# EAGLE design Hermit Board Rev A3 (EAGLE 6.6.0)
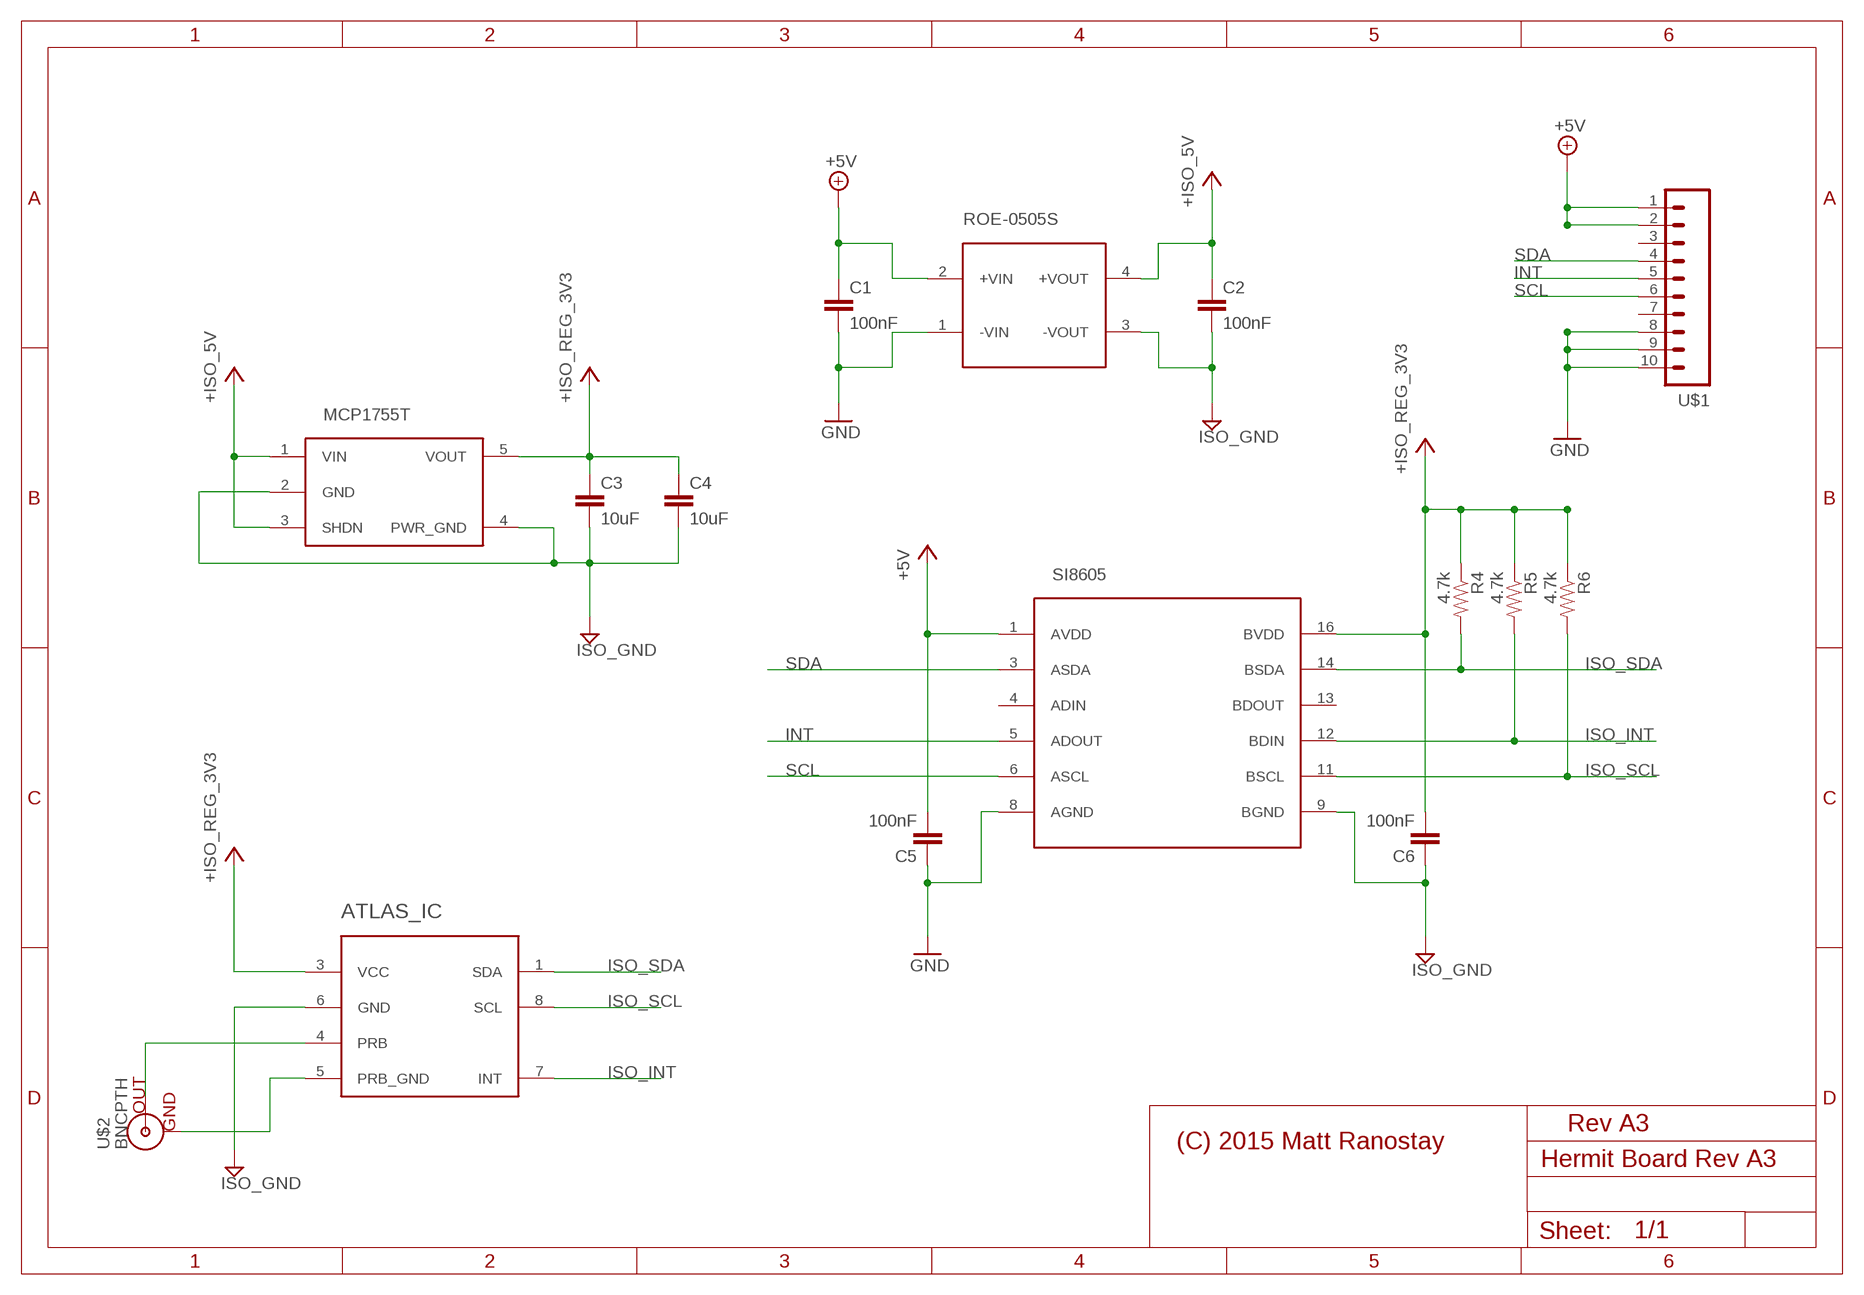
[diagram p0: schematic, sheet 1]

## Parts
ATLAS_IC  ATLAS-OEM  [ATLAS-OEM]
C1  100nF  CAP0805  [0805]
C2  100nF  CAP0805  [0805]
C3  10uF  CAP0805  [0805]
C4  10uF  CAP0805  [0805]
C5  100nF  CAP0805  [0805]
C6  100nF  CAP0805  [0805]
MCP1755T  MCP1755T  [SOT-23-5]
R4  4.7k  RESISTOR0805-RES  [0805]
R5  4.7k  RESISTOR0805-RES  [0805]
R6  4.7k  RESISTOR0805-RES  [0805]
ROE-0505S  ROE-0505S  [SIP4]
SI8605  SI8605  [SOIC16-1.27-10X3.9MM]
U$1  M10SILK_FEMALE_PTH  [1X10]
U$2  BNCPTH  [BNC]

## Nets
+3V3: ATLAS_IC.3(VCC) C3.1 C4.1 C6.2 MCP1755T.5(VOUT) R4.1 R5.1 R6.1 SI8605.16(BVDD) ; supply symbol labelled +ISO_REG_3V3
+5V: C1.1 C5.2 ROE-0505S.2(+VIN) SI8605.1(AVDD) U$1.1 U$1.2
+ISO_5V: C2.1 MCP1755T.1(VIN) MCP1755T.3(SHDN) ROE-0505S.4(+VOUT)
GND: C1.2 C5.1 ROE-0505S.1(-VIN) SI8605.8(AGND) U$1.8 U$1.9 U$1.10
INT: SI8605.5(ADOUT) U$1.5
ISO_GND: ATLAS_IC.6(GND) C2.2 C3.2 C4.2 C6.1 MCP1755T.2(GND) MCP1755T.4(PWR_GND) ROE-0505S.3(-VOUT) SI8605.9(BGND)
ISO_INT: ATLAS_IC.7(INT) R5.2 SI8605.12(BDIN)
ISO_SCL: ATLAS_IC.8(SCL) R6.2 SI8605.11(BSCL)
ISO_SDA: ATLAS_IC.1(SDA) R4.2 SI8605.14(BSDA)
N$5: ATLAS_IC.4(PRB) U$2.S(OUT)
PRB_GND: ATLAS_IC.5(PRB_GND) U$2.GND
SCL: SI8605.6(ASCL) U$1.6
SDA: SI8605.3(ASDA) U$1.4
Unconnected: SI8605.4(ADIN) SI8605.13(BDOUT) U$1.3 U$1.7

## Notes on the sheet
- Rev A3
- (C) 2015 Matt Ranostay

## Library data of the parts
ATLAS_IC = mranostay:ATLAS-OEM
C1-C6 = SparkFun-Capacitors:CAP: Capacitor Standard 0603 ceramic capacitor, and 0.1" leaded capacitor.
MCP1755T = mranostay:MCP1755T
R4-R6 = SparkFun-Passives:RESISTOR: Resistor Basic schematic elements and footprints for 0603, 1206, and PTH resistors.
ROE-0505S = mranostay:ROE-0505S
SI8605 = mranostay:SI8605
U$1 = SparkFun-Connectors:M10: Header 10 Standard 10-pin 0.1" header. Use with straight break away headers (SKU : PRT-00116), right angle break away headers (PRT-00553), swiss pins (PRT-00743), machine pins (PRT-00117), and female headers (PRT-00115).; PROD_ID: CONN-11563
U$2 = SparkFun-Connectors:BNC: BNC Connector, Mouser Part# 5227161

## Board
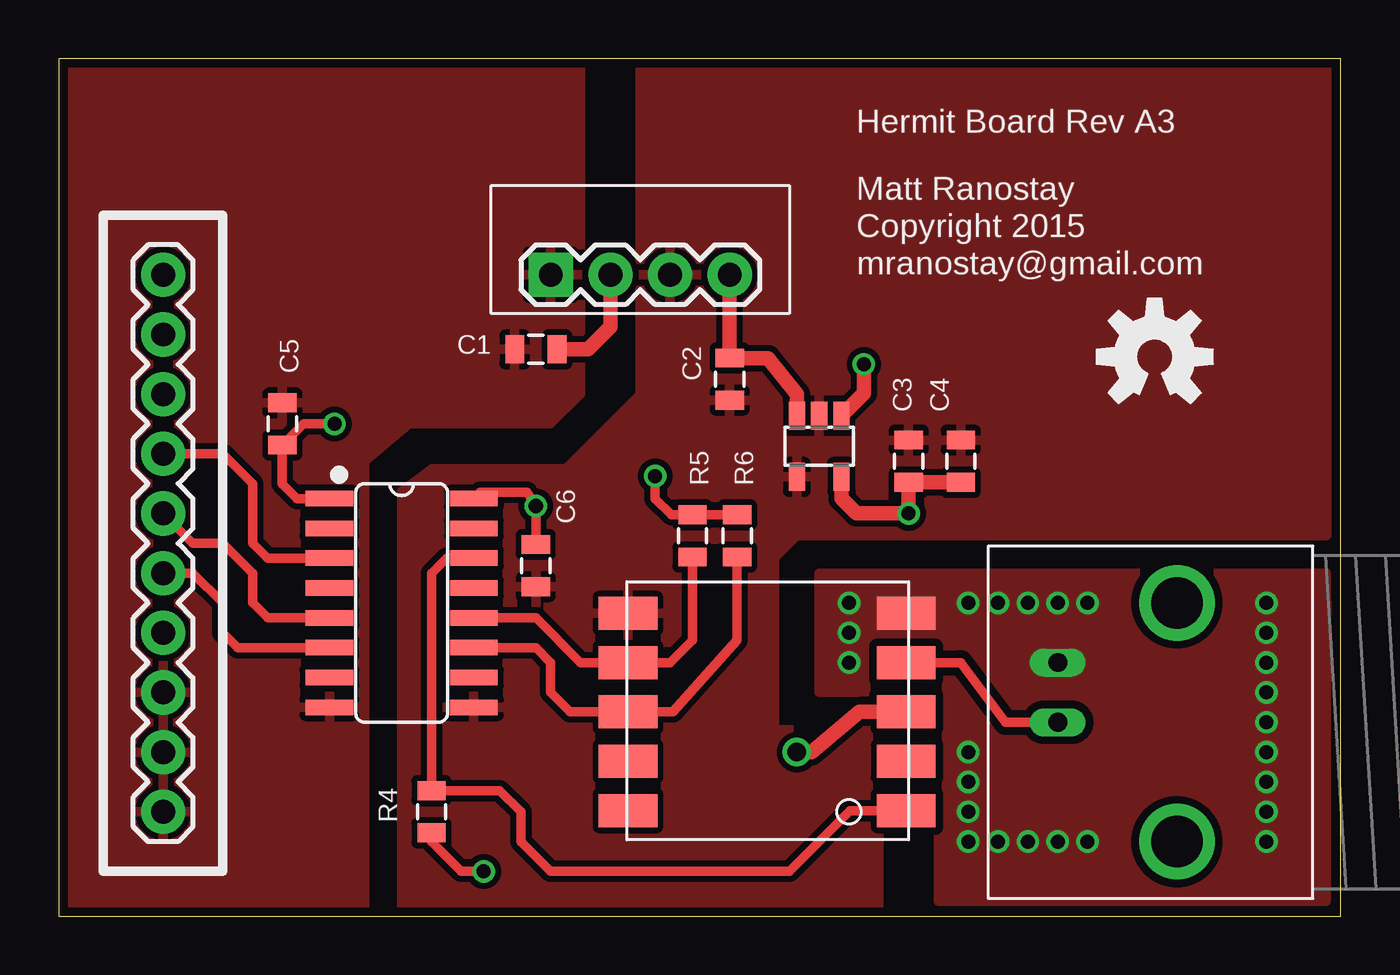
[diagram p1: board, top side]
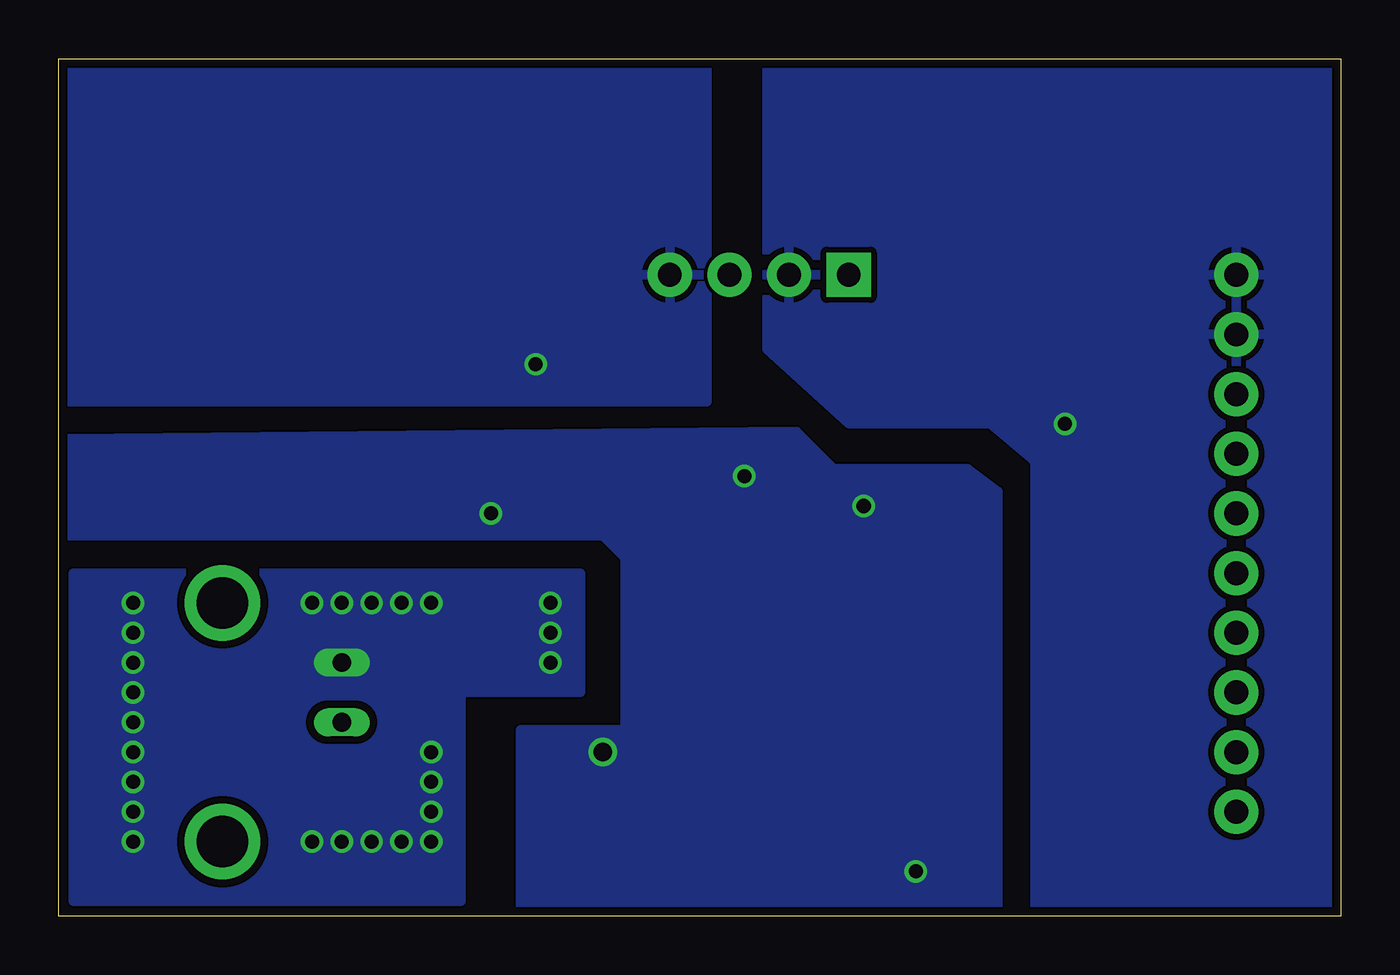
[diagram p2: board, bottom side, seen from below]

Size 54.6 x 36.5 mm. Coordinates in mm from the lower left corner, seen from the top.
Outline: 0,0 54.6,0 54.6,36.5 0,36.5 0,0
Copper layers (1*16): Top 0.0356mm / dielectric 1.5011mm / Bottom 0.0356mm
Design rules "oshpark-2layer": minimum track width 6mil, minimum drill 13mil, track to track 6mil, track to pad 6mil, pad to pad 6mil, via to via 6mil, smd to smd 6mil, copper to edge 15mil, drill to drill 6mil, minimum pad ring 7mil, minimum via ring 7mil, stop-mask expansion 2.5mil, vias tented up to drill 0mil, thermal gap 10mil

### Footprints (pad centres in the part's own frame; a part is rotated, then mirrored left to right if it is on the bottom)
ATLAS-OEM = smd 2.5 x 1.4: 1 -6.25,5.03; 2 -6.25,2.93; 3 -6.25,0.83; 4 -6.25,-1.27; 5 -6.25,-3.37; 6 5.601,-3.37; 7 5.601,-1.27; 8 5.601,0.83; 9 5.601,2.93; 10 5.601,5.03
0805 = smd 0.8 x 1.2: 1 -0.9,0; 2 0.9,0
SOT-23-5 = smd 0.69 x 1.2: 1 -0.95,-1.3; 2 0,-1.3; 3 0.95,-1.3; 4 0.95,1.3; 5 -0.95,1.3
SIP4 = drill 1.016 pad 1.88 square: 1 0,0 | drill 1.016 pad 1.88: 2 2.54,0; 3 5.08,0; 4 7.62,0
SOIC16-1.27-10X3.9MM = smd 0.66 x 2.032: 1 -4.445,-3.073; 2 -3.175,-3.073; 3 -1.905,-3.073; 4 -0.635,-3.073; 5 0.635,-3.073; 6 1.905,-3.073; 7 3.175,-3.073; 8 4.445,-3.073; 9 4.445,3.073; 10 3.175,3.073; 11 1.905,3.073; 12 0.635,3.073; 13 -0.635,3.073; 14 -1.905,3.073; 15 -3.175,3.073; 16 -4.445,3.073
1X10 = drill 1.016 pad 1.88: 1 0,0; 2 2.54,0; 3 5.08,0; 4 7.62,0; 5 10.16,0; 6 12.7,0; 7 15.24,0; 8 17.78,0; 9 20.32,0; 10 22.86,0
BNC = drill 2.2: 3 -5.08,5.08; 4 5.08,5.08 | drill 0.8 long: GND -2.54,0; S 0,0

### Placement (x,y rotation side)
ATLAS_IC  29.85,9.52 180 top
C1  20.32,24.13 180 top
C2  28.57,22.86 270 top
C3  36.19,19.37 90 top
C4  38.42,19.37 90 top
C5  9.52,20.95 270 top
C6  20.32,14.92 90 top
MCP1755T  32.39,20 180 top
R4  15.88,4.45 90 top
R5  26.99,16.19 270 top
R6  28.89,16.19 270 top
ROE-0505S  20.96,27.3 0 top
SI8605  14.61,13.34 270 top
U$1  4.45,27.3 270 top
U$2  42.55,8.25 270 top
U$3  [OSHW-LOGO-M]  46.67,23.81 0 top

### Tracks (layer width: path | path; a pad name or v marks a point on that pad's centre or on a via)
+3V3  (via drill 0.6, 0.8)
  Top 0.406: R4.1 15.88,3.17 17.14,1.91 v18.1,1.91 | R6.1 R5.1 26.09,17.09 25.4,17.78 v25.4,18.73 | SI8605.16 17.94,18.05 19.95,18.05 v20.32,17.46 C6.2
  Top 0.61: MCP1755T.5 33.33,17.78 33.97,17.14 v36.19,17.14 C3.1 C4.1 | ATLAS_IC.3 34.09,8.7 32.07,6.98 v31.43,6.98
  pour Bottom (isolate 0.254): 14.61,0 14.61,18.1 15.88,19.05 21.59,19.05 23.18,20.64 54.29,20.32 54.29,16.19 31.43,16.19 30.48,15.24 30.48,7.94 34.92,7.94 34.92,0
+5V  (via drill 0.6)
  Top 0.406: SI8605.1 10.16,17.78 9.52,18.41 C5.2 10.43,20.95 v11.75,20.95
  Top 0.61: ROE-0505S.2 23.5,25.08 22.54,24.13 C1.1
  pour Bottom (isolate 0.254): 0,0 0,36.51 24.45,36.51 24.45,24.13 20.96,20.95 14.92,20.95 13.02,19.37 13.02,0
+ISO_5V  (via drill 0.6)
  Top 0.61: ROE-0505S.4 C2.1 30.21,23.76 31.43,22.22 MCP1755T.3 | MCP1755T.1 34.29,22.26 v34.29,23.5
  pour Bottom: 26.99,36.19 26.99,21.91 54.29,21.91 54.29,36.19 27.3,36.19 27.3,35.88
GND
  pour Top (isolate 0.254): 0,0 0,36.51 21.91,36.51 22.22,36.19 22.22,22.22 20.96,20.95 14.92,20.95 13.02,19.37 13.02,0
INT
  Top 0.406: SI8605.5 8.89,12.7 8.25,13.34 8.25,14.6 6.98,15.88 5.71,15.88 U$1.5
ISO_GND
  pour Top (isolate 0.254): 14.61,0 14.61,18.1 15.88,19.05 21.59,19.05 24.76,22.22 24.76,36.19 54.29,36.19 54.29,16.51 53.97,16.19 31.43,16.19 30.48,15.24 30.48,7.94 34.92,7.94 34.92,0.32
ISO_INT
  Top 0.406: SI8605.12 20.32,12.7 22.22,10.8 ATLAS_IC.7 26.04,10.8 26.99,11.75 R5.2
ISO_SCL
  Top 0.406: 23.5,8.25 23.93,8.7 ATLAS_IC.8 | ATLAS_IC.8 24.68,8.25 | SI8605.11 20.32,11.43 20.96,10.8 20.96,9.52 21.79,8.7 ATLAS_IC.8 | ATLAS_IC.8 26.16,8.7 28.89,11.75 R6.2
ISO_SDA
  Top 0.406: SI8605.14 16.51,15.24 15.88,14.6 R4.2 18.79,5.34 19.68,4.45 19.68,3.17 20.96,1.91 31.11,1.91 33.7,4.49 ATLAS_IC.1
N$5
  Top 0.406: ATLAS_IC.4 38.42,10.8 40.32,8.25 U$2.S
PRB_GND  (via drill 0.6, 0.6 pad 0.81)
  other vias: 33.66,13.34 33.66,12.06 33.66,10.8 38.73,13.34 40,13.34 41.28,13.34 42.55,13.34 43.81,13.34 38.73,6.98 38.73,4.45 38.73,3.17 40,3.17 41.28,3.17 42.55,3.17 43.81,3.17 38.73,5.71 51.44,13.34 51.44,10.8 51.44,8.25 51.44,6.98 51.44,9.52 51.44,12.06 51.44,3.17 51.44,5.71 51.44,4.45
  pour Bottom (isolate 0.33, no thermals): 32.39,14.6 53.97,14.6 53.97,0.63 37.47,0.63 37.47,9.52 32.39,9.52
  pour Top (isolate 0.33, no thermals): 32.39,14.6 32.39,9.52 37.47,9.52 37.47,0.63 53.97,0.63 53.97,14.6
SCL
  Top 0.406: SI8605.6 7.62,11.43 6.98,12.06 6.98,13.34 5.71,14.6 U$1.6
SDA
  Top 0.406: SI8605.3 8.89,15.24 8.25,15.88 8.25,18.41 6.98,19.68 U$1.4

### Text on the board
tPlace: Hermit Board Rev A3 | Matt Ranostay | Copyright 2015 | mranostay@gmail.com